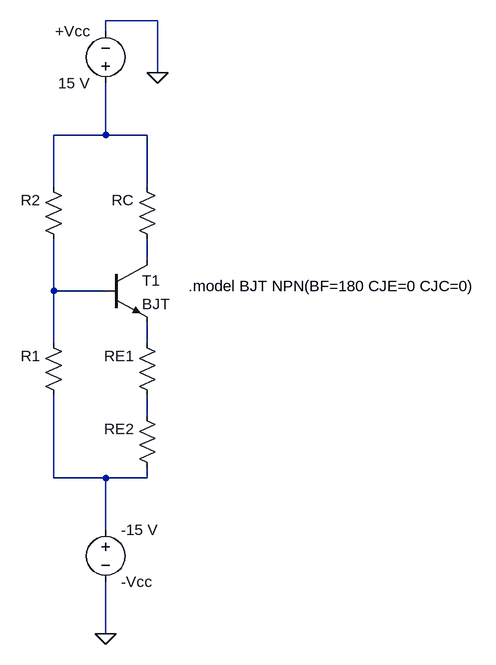
[diagram p0: schematic faz1_DC_eqv.asc]
faz1_DC_eqv.asc, the LTspice schematic file:
Version 4
SHEET 1 880 768
WIRE 64 -304 -16 -304
WIRE -16 -288 -16 -304
WIRE 64 -224 64 -304
WIRE -16 -128 -16 -208
WIRE -16 -128 -96 -128
WIRE 48 -128 -16 -128
WIRE -96 -48 -96 -128
WIRE 48 -48 48 -128
WIRE 48 64 48 32
WIRE -96 112 -96 32
WIRE -16 112 -96 112
WIRE -96 192 -96 112
WIRE 48 192 48 160
WIRE 48 304 48 272
WIRE -96 400 -96 272
WIRE -16 400 -96 400
WIRE 48 400 48 384
WIRE 48 400 -16 400
WIRE -16 480 -16 400
WIRE -16 640 -16 560
FLAG 64 -224 0
FLAG -16 640 0
SYMBOL res -80 48 R180
WINDOW 0 36 76 Left 2
WINDOW 3 36 40 Left 2
SYMATTR InstName R2
SYMATTR Value ""
SYMBOL res -80 288 R180
WINDOW 0 36 76 Left 2
WINDOW 3 36 40 Left 2
SYMATTR InstName R1
SYMATTR Value ""
SYMBOL npn -16 64 R0
SYMATTR InstName T1
SYMATTR Value BJT
SYMBOL res 64 48 R180
WINDOW 0 36 76 Left 2
WINDOW 3 36 40 Left 2
SYMATTR InstName RC
SYMATTR Value ""
SYMBOL res 64 288 R180
WINDOW 0 36 76 Left 2
WINDOW 3 36 40 Left 2
SYMATTR InstName RE1
SYMATTR Value ""
SYMBOL res 64 400 R180
WINDOW 0 36 76 Left 2
WINDOW 3 36 40 Left 2
SYMATTR InstName RE2
SYMATTR Value ""
SYMBOL voltage -16 464 R0
WINDOW 0 24 96 Left 2
WINDOW 3 24 16 Left 2
WINDOW 123 0 0 Left 0
WINDOW 39 0 0 Left 0
SYMATTR InstName -Vcc
SYMATTR Value -15 V
SYMBOL voltage -16 -192 R180
WINDOW 0 24 96 Left 2
WINDOW 3 24 16 Left 2
WINDOW 123 0 0 Left 0
WINDOW 39 0 0 Left 0
SYMATTR InstName +Vcc
SYMATTR Value 15 V
TEXT 112 104 Left 2 !.model BJT NPN(BF=180 CJE=0 CJC=0)

The netlist it stands for:
* faz1_DC_eqv.asc
R2 N003 N001
R1 N006 N003
Q§T1 N002 N003 N004 0 BJT
RC N002 N001
RE1 N005 N004
RE2 N006 N005
V§-Vcc N006 0 -15 V
V§+Vcc N001 0 15 V
.model NPN NPN
.model PNP PNP
.lib standard.bjt
.model BJT NPN(BF=180 CJE=0 CJC=0)
.backanno
.end